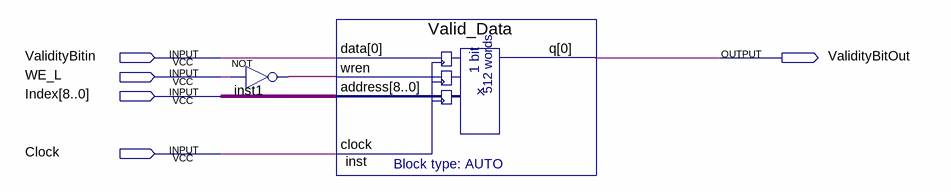
[diagram p0: schematic sheet]
// Quartus schematic Valid.bdf as structural Verilog: 2 symbols, 5 pins
module Valid (
  input  ValidityBitin,
  input  WE_L,
  input  [8:0] Index,
  input  Clock,
  output ValidityBitOut
);

  wire inst1_out;

  not inst1 (inst1_out, WE_L);
  Valid_Data inst (.data(ValidityBitin), .wren(inst1_out), .address(Index), .clock(Clock), .q(ValidityBitOut));
endmodule
